# Altium schematic sheet Misc.SchDoc: Primary Side Hardware - Miscellaneous
size A4; Author: Primary Team; Revision: A; SheetNumber: 3; SheetTotal: 3
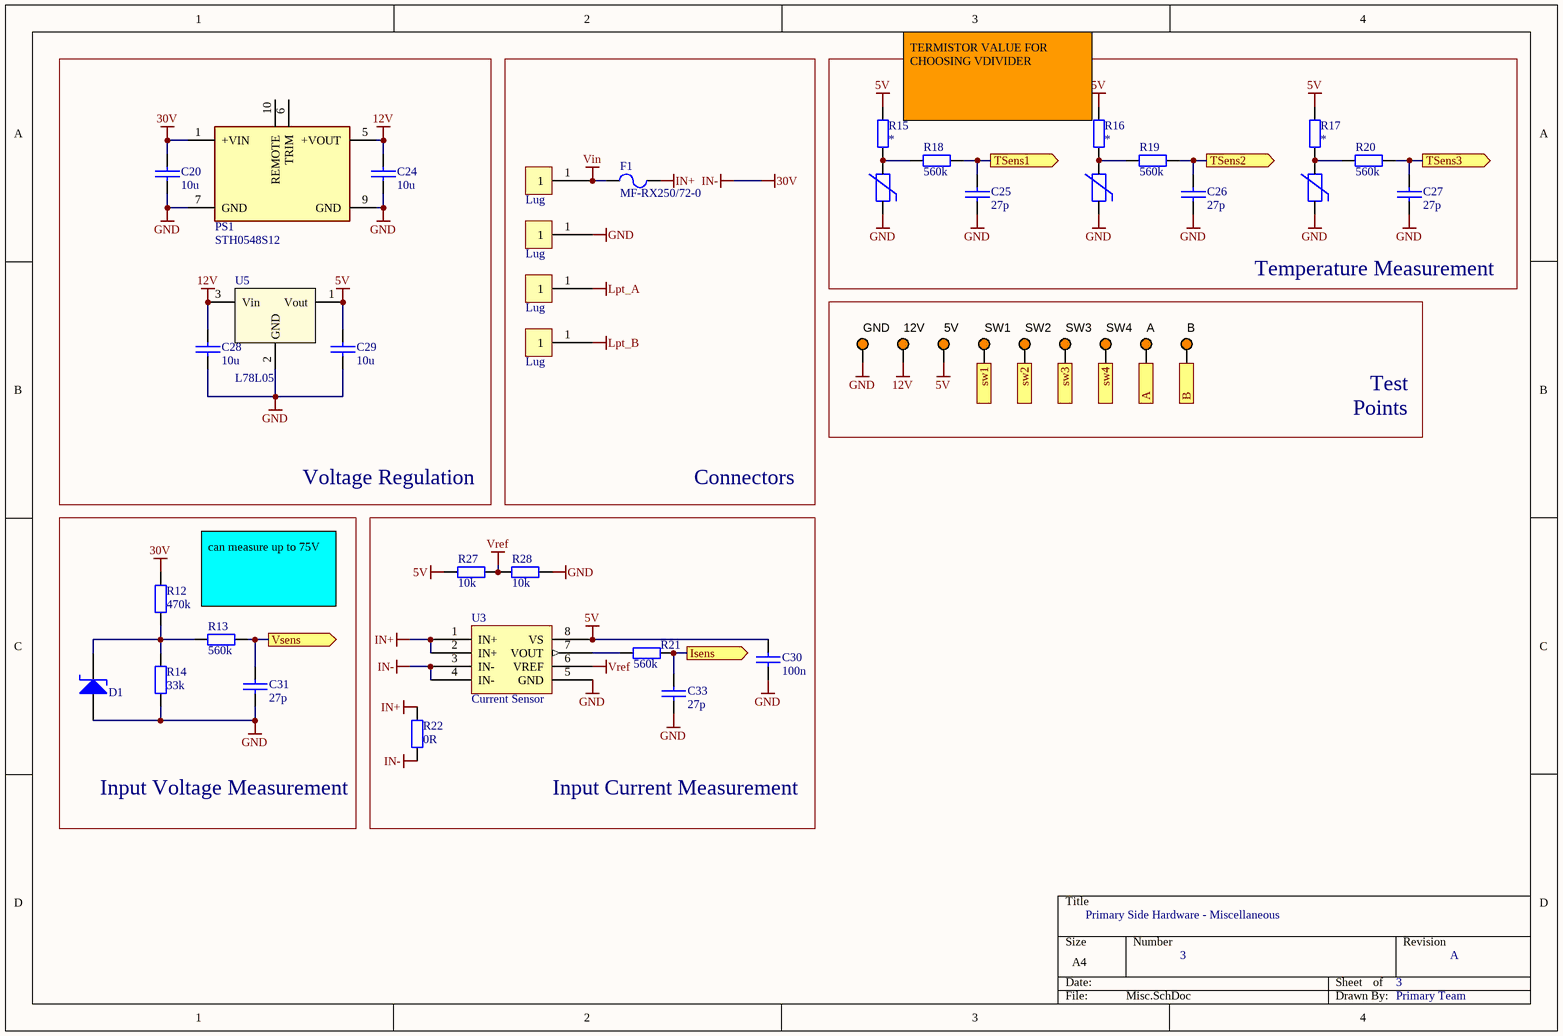
[diagram p0: Misc.SchDoc]

## Parts
5V  5003  [TP_TH]  (value not drawn)
12V  5003  [TP_TH]  (value not drawn)
A  5003  [TP_TH]  (value not drawn)
B  5003  [TP_TH]  (value not drawn)
C20  10u  [C1210]
C24  10u  [C1210]
C25  27p  [C0805]
C26  27p  [C0805]
C27  27p  [C0805]
C28  10u  [C1210]
C29  10u  [C1210]
C30  100n  [C0805]
C31  27p  [C0805]
C33  27p  [C0805]
D1  BZT52H-B5V1  [SOD123]  (value not drawn)
F1  MF-RX250/72-0  [TH_FUSE]
GND  5003  [TP_TH]  (value not drawn)
P2  Lug  [M3 Lug]
P3  Lug  [M4 Lug]
P4  Lug  [M4 Lug]
P5  Lug  [M3 Lug]
PS1  STH0548S12  [STH0548S12]
R12  470k  [R0805]
R13  560k  [R0805]
R14  33k  [R0805]
R15  *  [R0805]
R16  *  [R0805]
R17  *  [R0805]
R18  560k  [R0805]
R19  560k  [R0805]
R20  560k  [R0805]
R21  560k  [R0805]
R22  0R  [R0805]
R27  10k  [R0805]
R28  10k  [R0805]
SW1  5003  [TP_TH]  (value not drawn)
SW2  5003  [TP_TH]  (value not drawn)
SW3  5003  [TP_TH]  (value not drawn)
SW4  5003  [TP_TH]  (value not drawn)
T1  Thermistor  [LeadedThermistor]  (value not drawn)
T2  Thermistor  [LeadedThermistor]  (value not drawn)
T3  Thermistor  [LeadedThermistor]  (value not drawn)
U3  Current Sensor  [I-SOIC8]
U5  L78L05  [SOT-89]

## Blocks framed on the sheet
Voltage Regulation: C20 C24 C28 C29 PS1 U5
Connectors: F1 P2-P5
Temperature Measurement: C25-C27 R15-R20 T1-T3
Input Voltage Measurement: C31 D1 R12-R14
Input Current Measurement: C30 C33 R21 R22 R27 R28 U3

## Ports
A (out), B (out), Isens (out), sw1 (out), sw2 (out), sw3 (out), sw4 (out), TSens1 (out), TSens2 (out), TSens3 (out), Vsens (out)

## Nets
5V: 5V.1 C29.1 C30.1 R15.2 R16.2 R17.2 R27.1 U3.8(VS) U5.1(Vout)
12V: 12V.1 C24.1 C28.1 PS1.5(+VOUT) U5.3(Vin)
30V: C20.1 PS1.1(+VIN) R12.2 R22.2 U3.3(IN-) U3.4(IN-)  [also labelled IN-]
GND: C20.2 C24.2 C25.2 C26.2 C27.2 C28.2 C29.2 C30.2 C31.2 C33.2 D1.1(A) GND.1 P5.1 PS1.7(GND) PS1.9(GND) R14.1 R28.2 T1.1 T2.1 T3.1 U3.5(GND) U5.2(GND)
IN+: F1.2 R22.1 U3.1(IN+) U3.2(IN+)
Lpt_A: P3.1
Lpt_B: P4.1
Vin: F1.1 P2.1
Vref: R27.2 R28.1 U3.6(VREF)
A: A.1 ; port A
B: B.1 ; port B
Isens: C33.1 R21.1 ; port Isens
sw1: SW1.1 ; port sw1
sw2: SW2.1 ; port sw2
sw3: SW3.1 ; port sw3
sw4: SW4.1 ; port sw4
TSens1: C25.1 R18.1 ; port TSens1
TSens2: C26.1 R19.1 ; port TSens2
TSens3: C27.1 R20.1 ; port TSens3
Vsens: C31.1 R13.1 ; port Vsens
NetD1_2: D1.2(K) R12.1 R13.2 R14.2
NetR15_1: R15.1 R18.2 T1.2
NetR16_1: R16.1 R19.2 T2.2
NetR17_1: R17.1 R20.2 T3.2
NetR21_2: R21.2 U3.7(VOUT)

Not connected (* = marked no-connect by the designer): PS1 6(TRIM) 10(REMOTE)

## Notes on the sheet
- (near R16) TERMISTOR VALUE FOR CHOOSING VDIVIDER
- (near P4) Text
- Test Points
- can measure up to 75V
- Primary Team

## Library data of the parts
5V 12V A B GND SW1-SW4 = TestPoint: Test Point, Orange, 1-Pin THD, RoHS; Peak Reverse Current: 600 uA; Forward Current: 3 A; Max Surge Current: 80 A; Forward Voltage: 1.08 V; Max Operating Temperature: 150 degC; PackageReference: 5003; Pins: 2; ComponentLink2URL: http://keyelco.com/userAssets/file/M65p56.pdf; PackageDescription: 1-Pin Through Hole Device, Dia 2.54 mm; Weight: 0.01 lb; Diameter: 5.3 mm; Mount: Through Hole; Package Quantity: 500; Packaging: Bulk; Min Operating Temperature: -65 degC; ComponentLink1Description: Manufacturer URL; Height: 0.25 inch; ComponentLink1URL: http://www.keyelco.com/; ComponentLink2Description: Datasheet; Width: 0.25 inch; REACH SVHC: No SVHC; RoHSCompliant: true; Radiation Hardening: No; Length: 9.5 mm; DatasheetVersion: Jun-15
C20 C24-C31 C33 = CerCap_SMT: SMT ceramic capacitor selectable size
  C20 C24 C28 C29: Value: 10u
  C25-C27 C31 C33: Value: 27p
  C30: Value: 100n
D1 = Zener_SMT_SOD123: SMT zener diode with SOD123 package; Manufacturer: Nexperia USA Inc.; Manufacturer Part Number: BZT52H-B5V1,115; Tolerance: ±2%; RoHS: RoHS Compliant; Category: Discrete Semiconductor Products; Stock 1: 0; Pricing 1: 1=0.51, 10=0.408, 100=0.2164, 500=0.14232, 1000=0.09678 (NZD); Packaging: Cut Tape (CT); Part Status: Active; Operating Temperature: -65°C ~ 150°C (TA); Mounting Type: Surface Mount; Package / Case: SOD-123F; Supplier Device Package: SOD-123F; ComponentLink1URL: https://assets.nexperia.com/documents/data-sheet/BZT52H_SER.pdf; ComponentLink1Description: https://assets.nexperia.com/documents/data-sheet/BZT52H_SER.pdf; Supplier 1: Digi-Key
F1 = MF-RX250/72-0: PTC Resettable Fuse 2.5A(hold) 5A(trip) 72V 40A 2.5W 15.6s 0.05Ohm Radial 17.84 X 3.1 X 23.84mm Bulk; Manufacturer: Bourns; Number of Terminals/Pins: 2; Body Material: Polymer,Epoxy; Resistance: 80mR; Voltage Rating (AC): 60V; Lead Diameter: 0.81mm; Body Length: 17.84mm; Lead Length: 7.6mm; Body Diameter: 21.3mm; Approvals: UL; Supplier 1: Digi-Key; Manufacturer Part Number: MF-RX250/72-0; RoHS: Yes; Category: PTC Resettable Fuses; Stock 1: 206; Pricing 1: 1=0.60000, 5=0.58400, 10=0.56700, 50=0.47700, 100=0.39600, 250=0.36000, 500=0.30600, 1000=0.27000, 5000=0.24300 (USD); Mount: Through Hole,PCB; Case/Package: Radial; Number of Pins: 2; Contact Plating: Tin; Min Operating Temperature: -40°C; Max Operating Temperature: 85°C; Max Current Rating: 40A; Hold Current: 2.5A; Trip Current: 5A; Power Dissipation: 2.5W; Packaging: Bulk; Package Quantity: 500; Termination: Radial; Series: MF-RX/72; Time to Trip: 15.6s; Operating Supply Voltage: 72V; Voltage Rating: 72V; Current Rating: 40A; Max Power Dissipation: 2.5W; Voltage Rating (DC): 72V; Length: 31.44mm; Width: 17.84mm; Height: 3.1mm; Lead Pitch: 10.2mm; Terminal Pitch: 10.2mm; Wire/Cable Diameter: 0.81mm; Body Height: 23.84mm; Thickness: 3.1mm; Radiation Hardening: No; RoHS Compliant: Yes; REACH SVHC: No SVHC; Lead Free: Lead Free; Flammability Rating: UL94 V-0; ComponentLink1URL: https://datasheet.ciiva.com/1274/1727898-1274752.pdf?src-supplier=Element14; ComponentLink1Description: https://datasheet.ciiva.com/1274/1727898-1274752.pdf?src-supplier=Element14; ComponentLink2URL: https://datasheet.ciiva.com/3019/mfrx72-3019851.pdf?src-supplier=Avnet; ComponentLink2Description: https://datasheet.ciiva.com/3019/mfrx72-3019851.pdf?src-supplier=Avnet; ComponentLink3URL: https://datasheet.ciiva.com/4501/mfrx72-4501292.pdf?src-supplier=Mouser; ComponentLink3Description: https://datasheet.ciiva.com/4501/mfrx72-4501292.pdf?src-supplier=Mouser; ComponentLink4URL: https://datasheet.ciiva.com/32425/mf-rx72-series-eng-tds-32425991.pdf?src-supplier=Distrelec; ComponentLink4Description: https://datasheet.ciiva.com/32425/mf-rx72-series-eng-tds-32425991.pdf?src-supplier=Distrelec; ComponentLink5URL: https://datasheet.ciiva.com/326/mfrx72-326639.pdf?src-supplier=Digi-Key; ComponentLink5Description: https://datasheet.ciiva.com/326/mfrx72-326639.pdf?src-supplier=Digi-Key; ComponentLink6URL: https://datasheet.ciiva.com/17401/mfrx72-17401583.pdf?src-supplier=Avnet+Europe; ComponentLink6Description: https://datasheet.ciiva.com/17401/mfrx72-17401583.pdf?src-supplier=Avnet+Europe; ComponentLink7URL: https://datasheet.ciiva.com/14539/70153449-14539563.pdf?src-supplier=Allied+Electronics; ComponentLink7Description: https://datasheet.ciiva.com/14539/70153449-14539563.pdf?src-supplier=Allied+Electronics; ComponentLink8URL: https://datasheet.ciiva.com/15187/getdatasheetpartid-298829-15187739.pdf?src-supplier=Verical; ComponentLink8Description: https://datasheet.ciiva.com/15187/getdatasheetpartid-298829-15187739.pdf?src-supplier=Verical; ComponentLink9URL: https://datasheet.ciiva.com/30097/669mfrx72-30097310.pdf?src-supplier=Onlinecomponents.com; ComponentLink9Description: https://datasheet.ciiva.com/30097/669mfrx72-30097310.pdf?src-supplier=Onlinecomponents.com
PS1 = STH0548S12: Power Supply; Manufacturer_Name: XP POWER; Manufacturer_Part_Number: STH0548S15; Datasheet Link: https://4donline.ihs.com/images/VipMasterIC/IC/XPPO/XPPO-S-A0009456324/XPPO-S-A0009456324-1.pdf?hkey=EF798316E3902B6ED9A73243A3159BB0; Height: 5.5mm
R12-R22 = Res_SMT: 0805 or 1206 resistor; Published: 8-Jun-2000; LatestRevisionDate: 17-Jul-2002; LatestRevisionNote: Re-released for DXP Platform.; PackageReference: AXIAL-0.4; Publisher: Altium Limited; ComponentLink1Description: https://nz.mouser.com/datasheet/2/315/AOA0000C304-1149620.pdf
  R12: Value: 470k
  R13 R18-R21: Value: 560k
  R14: Value: 33k
  R15-R17: Value: *
  R22: Value: 0R
R27 R28 = Res_SMT: Resistor 0805 or 1206; Published: 8-Jun-2000; LatestRevisionDate: 17-Jul-2002; LatestRevisionNote: Re-released for DXP Platform.; PackageReference: AXIAL-0.4; Publisher: Altium Limited; Value: 10k; ComponentLink1Description: https://nz.mouser.com/datasheet/2/315/AOA0000C304-1149620.pdf
U3 = Current Sensor: TMCS1100; ComponentLink1Description: New link; ComponentLink1URL: https://www.ti.com/lit/ds/symlink/tmcs1100.pdf?ts=1642385371674&ref_url=https%253A%252F%252Fnz.mouser.com%252F
U5 = L78L05_SMT_SOT89: LDO Voltage Regulator 5V; ComponentLink1URL: http://www.st.com/content/ccc/resource/technical/document/datasheet/99/3b/7d/91/91/51/4b/be/CD00000544.pdf/files/CD00000544.pdf/jcr:content/translations/en.CD00000544.pdf; ComponentLink1Description: http://www.st.com/content/ccc/resource/technical/document/datasheet/99/3b/7d/91/91/51/4b/be/CD00000544.pdf/files/CD00000544.pdf/jcr:content/translations/en.CD00000544.pdf; Supplier 1: Digi-Key; Supplier Part Number 1: 497-1181-1-ND